# Altium project DStep.PrjPcb
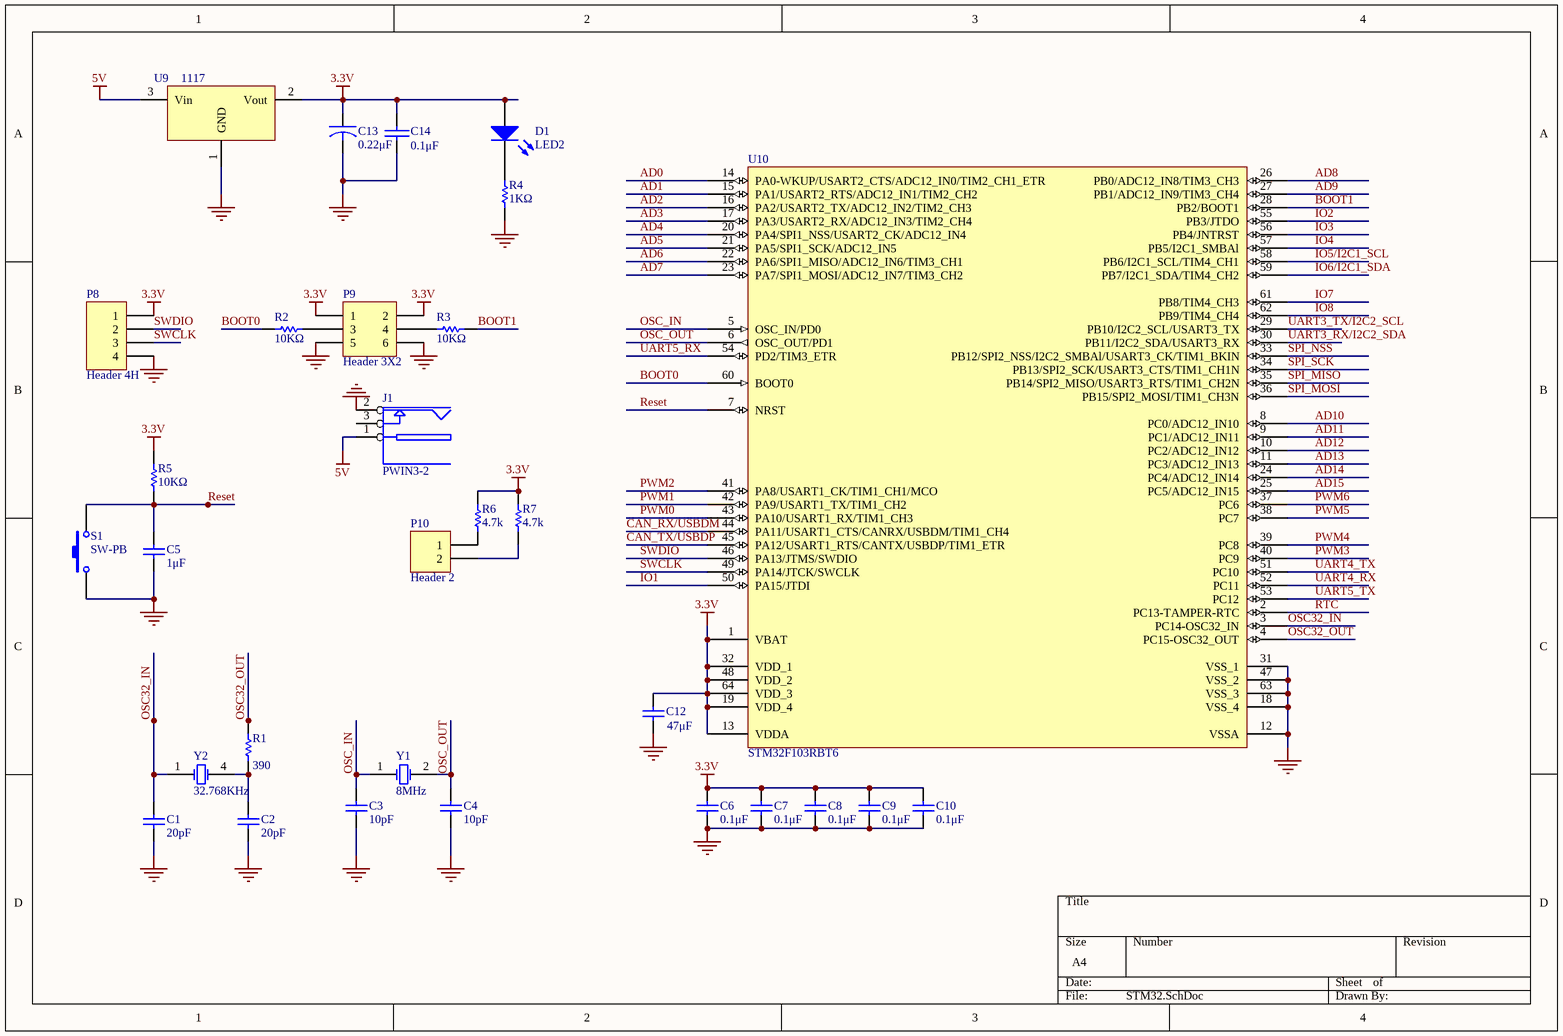
[diagram p0: STM32.SchDoc]
2 sheets, 37 parts. Net scope: global (net labels, ports and power ports of the same name join across sheets).
Board file: DStep.PcbDoc
Sheets:
  STM32.SchDoc
  Connector.SchDoc

## Sheet STM32.SchDoc
size A4; SheetNumber: 0; SheetTotal: 0

### Parts
C1  20pF  [C0603]
C2  20pF  [C0603]
C3  10pF  [C0603]
C4  10pF  [C0603]
C5  1μF  [C0603]
C6  0.1μF  [C0603]
C7  0.1μF  [C0603]
C8  0.1μF  [C0603]
C9  0.1μF  [C0603]
C10  0.1μF  [C0603]
C12  47μF  [C1210]
C13  0.22μF  [C0603]
C14  value 0.1μF  [C0603]  (hidden comment: CAP)
D1  LED2  [LED_0805]
J1  PWIN3-2  [DC-005]
P8  Header 4H  [HDR1X4H]
P9  Header 3X2  [HDR2X3]
P10  Header 2  [HDR1X2]
R1  value 390  [R0603]  (hidden comment: Res1)
R2  value 10KΩ  [R0603]  (hidden comment: Res1)
R3  value 10KΩ  [R0603]  (hidden comment: Res1)
R4  value 1KΩ  [R0603]  (hidden comment: Res1)
R5  value 10KΩ  [R0603]  (hidden comment: Res1)
R6  value 4.7k  [R0603]  (hidden comment: Res1)
R7  value 4.7k  [R0603]  (hidden comment: Res1)
S1  SW-PB  [SW_PB4_A1]
U9  1117  [SOT223_L]
U10  STM32F103RBT6  [LQFP-64]
Y1  8MHz  [5032]
Y2  32.768KHz  [MC-306]

### Nets
3.3V: C6.2 C7.2 C8.2 C9.2 C10.2 C12.2 C13.1 C14.1 D1.1(A) P8.1 P9.1 P9.2 R5.1 R6.1 R7.1 U9.2(Vout) U10.1(VBAT) U10.13(VDDA) U10.19(VDD_4) U10.32(VDD_1) U10.48(VDD_2) U10.64(VDD_3)
5V: J1.1 U9.3(Vin)
GND: C1.1 C2.1 C3.1 C4.1 C5.1 C6.1 C7.1 C8.1 C9.1 C10.1 C12.1 C13.2 C14.2 J1.2 P8.4 P9.5 P9.6 R4.2 S1.1 U9.1(GND) U10.12(VSSA) U10.18(VSS_4) U10.31(VSS_1) U10.47(VSS_2) U10.63(VSS_3)
AD0: U10.14(PA0-WKUP/USART2_CTS/ADC12_IN0/TIM2_CH1_ETR)
AD1: U10.15(PA1/USART2_RTS/ADC12_IN1/TIM2_CH2)
AD2: U10.16(PA2/USART2_TX/ADC12_IN2/TIM2_CH3)
AD3: U10.17(PA3/USART2_RX/ADC12_IN3/TIM2_CH4)
AD4: U10.20(PA4/SPI1_NSS/USART2_CK/ADC12_IN4)
AD5: U10.21(PA5/SPI1_SCK/ADC12_IN5)
AD6: U10.22(PA6/SPI1_MISO/ADC12_IN6/TIM3_CH1)
AD7: U10.23(PA7/SPI1_MOSI/ADC12_IN7/TIM3_CH2)
AD8: U10.26(PB0/ADC12_IN8/TIM3_CH3)
AD9: U10.27(PB1/ADC12_IN9/TIM3_CH4)
AD10: U10.8(PC0/ADC12_IN10)
AD11: U10.9(PC1/ADC12_IN11)
AD12: U10.10(PC2/ADC12_IN12)
AD13: U10.11(PC3/ADC12_IN13)
AD14: U10.24(PC4/ADC12_IN14)
AD15: U10.25(PC5/ADC12_IN15)
BOOT0: R2.2 U10.60(BOOT0)
BOOT1: R3.1 U10.28(PB2/BOOT1)
CAN_RX/USBDM: U10.44(PA11/USART1_CTS/CANRX/USBDM/TIM1_CH4)
CAN_TX/USBDP: U10.45(PA12/USART1_RTS/CANTX/USBDP/TIM1_ETR)
IO1: U10.50(PA15/JTDI)
IO2: U10.55(PB3/JTDO)
IO3: U10.56(PB4/JNTRST)
IO4: U10.57(PB5/I2C1_SMBAl)
IO5/I2C1_SCL: U10.58(PB6/I2C1_SCL/TIM4_CH1)
IO6/I2C1_SDA: U10.59(PB7/I2C1_SDA/TIM4_CH2)
IO7: U10.61(PB8/TIM4_CH3)
IO8: U10.62(PB9/TIM4_CH4)
OSC32_IN: C1.2 U10.3(PC14-OSC32_IN) Y2.1(OSC1)
OSC32_OUT: R1.2 U10.4(PC15-OSC32_OUT)
OSC_IN: C3.2 U10.5(OSC_IN/PD0) Y1.1(OSC1)
OSC_OUT: C4.2 U10.6(OSC_OUT/PD1) Y1.2(OSC2)
PWM0: U10.43(PA10/USART1_RX/TIM1_CH3)
PWM1: U10.42(PA9/USART1_TX/TIM1_CH2)
PWM2: U10.41(PA8/USART1_CK/TIM1_CH1/MCO)
PWM3: U10.40(PC9)
PWM4: U10.39(PC8)
PWM5: U10.38(PC7)
PWM6: U10.37(PC6)
Reset: C5.2 R5.2 S1.2 U10.7(NRST)
RTC: U10.2(PC13-TAMPER-RTC)
SPI_MISO: U10.35(PB14/SPI2_MISO/USART3_RTS/TIM1_CH2N)
SPI_MOSI: U10.36(PB15/SPI2_MOSI/TIM1_CH3N)
SPI_NSS: U10.33(PB12/SPI2_NSS/I2C2_SMBAl/USART3_CK/TIM1_BKIN)
SPI_SCK: U10.34(PB13/SPI2_SCK/USART3_CTS/TIM1_CH1N)
SWCLK: P8.3 U10.49(PA14/JTCK/SWCLK)
SWDIO: P8.2 U10.46(PA13/JTMS/SWDIO)
UART3_RX/I2C2_SDA: U10.30(PB11/I2C2_SDA/USART3_RX)
UART3_TX/I2C2_SCL: U10.29(PB10/I2C2_SCL/USART3_TX)
UART4_RX: U10.52(PC11)
UART4_TX: U10.51(PC10)
UART5_RX: U10.54(PD2/TIM3_ETR)
UART5_TX: U10.53(PC12)
NetC2_2: C2.2 R1.1 Y2.4(OSC2)
NetD1_2: D1.2(K) R4.1
NetP9_3: P9.3 R2.1
NetP9_4: P9.4 R3.2
NetP10_1: P10.1 R6.2
NetP10_2: P10.2 R7.2

Not connected (* = marked no-connect by the designer): J1 3

### Library data of the parts
C1-C10 C12 = Cap: Capacitor; Published: 8-Jun-2000; LatestRevisionDate: 17-Jul-2002; LatestRevisionNote: Re-released for DXP Platform.; PackageReference: RAD-0.3; Publisher: Altium Limited; PackageDescription: Radial Cap, Thru-Hole; 2 Leads; 0.3 in Pin Spacing
  C1 C2: Value: 20pF
  C3 C4: Value: 10pF
  C5: Value: 1μF
  C6-C10: Value: 0.1μF
  C12: Value: 47μF
C13 = CAPACITOR
C14 = CAP: Capacitor
D1 = LED2: Typical RED, GREEN, YELLOW, AMBER GaAs LED; Published: 8-Jun-2000; LatestRevisionDate: 17-Jul-2002; LatestRevisionNote: Re-released for DXP Platform.; PackageVersion: Feb-2002; PackageReference: 3.2X1.6X1.1; Publisher: Altium Limited; PackageDescription: SM LED; 2 Flat Leads
P8 = Header 4H: Header, 4-Pin, Right Angle; LatestRevisionDate: 17-Jul-2002; LatestRevisionNote: Re-released for DXP Platform.; Publisher: Altium Limited
P9 = Header 3X2: Header, 3-Pin, Dual row; LatestRevisionDate: 17-Jul-2002; LatestRevisionNote: Re-released for DXP Platform.; Publisher: Altium Limited
P10 = Header 2: Header, 2-Pin; LatestRevisionDate: 17-Jul-2002; LatestRevisionNote: Re-released for DXP Platform.; Publisher: Altium Limited
R1-R7 = Res1: Resistor; Published: 8-Jun-2000; LatestRevisionDate: 17-Jul-2002; LatestRevisionNote: Re-released for DXP Platform.; PackageReference: AXIAL-0.3; Publisher: Altium Limited; PackageDescription: Axial Device, Thru-Hole; 2 Leads; 0.3 in Pin Spacing
S1 = SW-PB: Switch; Published: 24-Mar-1999; LatestRevisionDate: 17-Jul-2002; LatestRevisionNote: Re-released for DXP Platform.; PackageReference: SPST-2; Publisher: Altium Limited; PackageDescription: Switch; 2 Leads
U9 = VOLTREG
U10 = STM32F103RBT6: STM32 ARM-based 32-bit MCU with 128 Kbytes Flash, 64-pin LQFP, Industrial Temperature; Published: *; DatasheetVersion: *; PackageVersion: *; PackageReference: *; Publisher: *; PackageDescription: *; ComponentLink1Description: *; ComponentLink1URL: *; ComponentLink2Description: *; ComponentLink2URL: *
Y1 Y2 = XTAL: Crystal Oscillator; Published: 8-Jun-2000; LatestRevisionDate: 17-Jul-2002; LatestRevisionNote: Re-released for DXP Platform.; PackageReference: R38; Publisher: Altium Limited; PackageDescription: Crystal, Thru-Hole; 2 Leads; Body 3.1 x 8.2 mm (Dia.xH)
  Y1: Value: 8MHz
  Y2: Value: 32.768KHz

## Sheet Connector.SchDoc
size A4; SheetNumber: 0; SheetTotal: 0
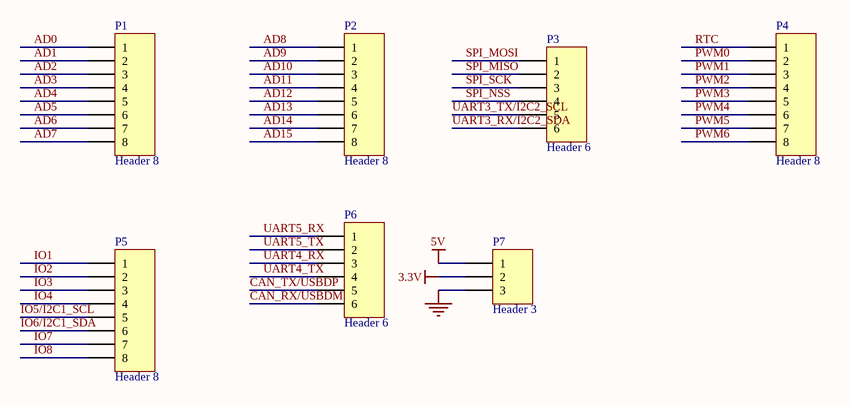
[diagram p1: Connector.SchDoc]

### Parts
P1  Header 8  [HDR1X8]
P2  Header 8  [HDR1X8]
P3  Header 6  [HDR1X6]
P4  Header 8  [HDR1X8]
P5  Header 8  [HDR1X8]
P6  Header 6  [HDR1X6]
P7  Header 3  [HDR1X3]

### Nets
3.3V: P7.2
5V: P7.1
GND: P7.3
AD0: P1.1
AD1: P1.2
AD2: P1.3
AD3: P1.4
AD4: P1.5
AD5: P1.6
AD6: P1.7
AD7: P1.8
AD8: P2.1
AD9: P2.2
AD10: P2.3
AD11: P2.4
AD12: P2.5
AD13: P2.6
AD14: P2.7
AD15: P2.8
CAN_RX/USBDM: P6.6
CAN_TX/USBDP: P6.5
IO1: P5.1
IO2: P5.2
IO3: P5.3
IO4: P5.4
IO5/I2C1_SCL: P5.5
IO6/I2C1_SDA: P5.6
IO7: P5.7
IO8: P5.8
PWM0: P4.2
PWM1: P4.3
PWM2: P4.4
PWM3: P4.5
PWM4: P4.6
PWM5: P4.7
PWM6: P4.8
RTC: P4.1
SPI_MISO: P3.2
SPI_MOSI: P3.1
SPI_NSS: P3.4
SPI_SCK: P3.3
UART3_RX/I2C2_SDA: P3.6
UART3_TX/I2C2_SCL: P3.5
UART4_RX: P6.3
UART4_TX: P6.4
UART5_RX: P6.1
UART5_TX: P6.2

### Library data of the parts
P1 P2 P4 P5 = Header 8: Header, 8-Pin; LatestRevisionDate: 17-Jul-2002; LatestRevisionNote: Re-released for DXP Platform.; Publisher: Altium Limited
P3 P6 = Header 6: Header, 6-Pin; LatestRevisionDate: 17-Jul-2002; LatestRevisionNote: Re-released for DXP Platform.; Publisher: Altium Limited
P7 = Header 3: Header, 3-Pin; LatestRevisionDate: 17-Jul-2002; LatestRevisionNote: Re-released for DXP Platform.; Publisher: Altium Limited

## Nets that join several sheets
3.3V: STM32 (22 pins), Connector (P7.2)
5V: STM32 (J1.1 U9.3), Connector (P7.1)
GND: STM32 (25 pins), Connector (P7.3)
AD0: STM32 (U10.14), Connector (P1.1)
AD1: STM32 (U10.15), Connector (P1.2)
AD2: STM32 (U10.16), Connector (P1.3)
AD3: STM32 (U10.17), Connector (P1.4)
AD4: STM32 (U10.20), Connector (P1.5)
AD5: STM32 (U10.21), Connector (P1.6)
AD6: STM32 (U10.22), Connector (P1.7)
AD7: STM32 (U10.23), Connector (P1.8)
AD8: STM32 (U10.26), Connector (P2.1)
AD9: STM32 (U10.27), Connector (P2.2)
AD10: STM32 (U10.8), Connector (P2.3)
AD11: STM32 (U10.9), Connector (P2.4)
AD12: STM32 (U10.10), Connector (P2.5)
AD13: STM32 (U10.11), Connector (P2.6)
AD14: STM32 (U10.24), Connector (P2.7)
AD15: STM32 (U10.25), Connector (P2.8)
CAN_RX/USBDM: STM32 (U10.44), Connector (P6.6)
CAN_TX/USBDP: STM32 (U10.45), Connector (P6.5)
IO1: STM32 (U10.50), Connector (P5.1)
IO2: STM32 (U10.55), Connector (P5.2)
IO3: STM32 (U10.56), Connector (P5.3)
IO4: STM32 (U10.57), Connector (P5.4)
IO5/I2C1_SCL: STM32 (U10.58), Connector (P5.5)
IO6/I2C1_SDA: STM32 (U10.59), Connector (P5.6)
IO7: STM32 (U10.61), Connector (P5.7)
IO8: STM32 (U10.62), Connector (P5.8)
PWM0: STM32 (U10.43), Connector (P4.2)
PWM1: STM32 (U10.42), Connector (P4.3)
PWM2: STM32 (U10.41), Connector (P4.4)
PWM3: STM32 (U10.40), Connector (P4.5)
PWM4: STM32 (U10.39), Connector (P4.6)
PWM5: STM32 (U10.38), Connector (P4.7)
PWM6: STM32 (U10.37), Connector (P4.8)
RTC: STM32 (U10.2), Connector (P4.1)
SPI_MISO: STM32 (U10.35), Connector (P3.2)
SPI_MOSI: STM32 (U10.36), Connector (P3.1)
SPI_NSS: STM32 (U10.33), Connector (P3.4)
SPI_SCK: STM32 (U10.34), Connector (P3.3)
UART3_RX/I2C2_SDA: STM32 (U10.30), Connector (P3.6)
UART3_TX/I2C2_SCL: STM32 (U10.29), Connector (P3.5)
UART4_RX: STM32 (U10.52), Connector (P6.3)
UART4_TX: STM32 (U10.51), Connector (P6.4)
UART5_RX: STM32 (U10.54), Connector (P6.1)
UART5_TX: STM32 (U10.53), Connector (P6.2)